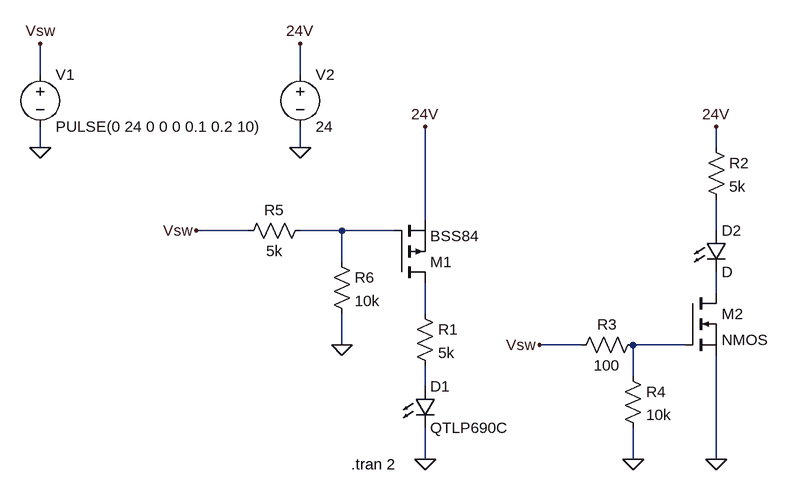
[diagram p0: schematic PMOS_OPEN_CKT_DETECT.asc]
PMOS_OPEN_CKT_DETECT.asc, the LTspice schematic file:
Version 4
SHEET 1 924 680
WIRE -592 -448 -592 -496
WIRE -192 -448 -192 -496
WIRE -592 -336 -592 -368
WIRE -192 -336 -192 -368
WIRE 448 -336 448 -368
WIRE 0 -224 0 -368
WIRE -272 -208 -352 -208
WIRE -128 -208 -192 -208
WIRE -48 -208 -128 -208
WIRE 448 -208 448 -256
WIRE -128 -160 -128 -208
WIRE 448 -112 448 -144
WIRE 0 -80 0 -128
WIRE -128 -32 -128 -80
WIRE 240 -32 176 -32
WIRE 400 -32 320 -32
WIRE 320 16 320 -32
WIRE 0 32 0 0
WIRE 0 144 0 96
WIRE 320 144 320 96
WIRE 448 144 448 -16
FLAG 0 144 0
FLAG 448 144 0
FLAG 448 -368 24V
FLAG 320 144 0
FLAG -128 -32 0
FLAG 176 -32 Vsw
FLAG -592 -336 0
FLAG -192 -336 0
FLAG -192 -496 24V
FLAG -592 -496 Vsw
FLAG -352 -208 Vsw
FLAG 0 -368 24V
SYMBOL pmos -48 -128 M180
SYMATTR InstName M1
SYMATTR Value BSS84
SYMBOL nmos 400 -112 R0
SYMATTR InstName M2
SYMBOL res -16 -96 R0
SYMATTR InstName R1
SYMATTR Value 5k
SYMBOL LED -16 32 R0
SYMATTR InstName D1
SYMATTR Value QTLP690C
SYMBOL res 432 -352 R0
SYMATTR InstName R2
SYMATTR Value 5k
SYMBOL LED 432 -208 R0
SYMATTR InstName D2
SYMBOL res 224 -16 R270
WINDOW 0 32 56 VTop 2
WINDOW 3 0 56 VBottom 2
SYMATTR InstName R3
SYMATTR Value 100
SYMBOL res 304 0 R0
SYMATTR InstName R4
SYMATTR Value 10k
SYMBOL res -288 -192 R270
WINDOW 0 32 56 VTop 2
WINDOW 3 0 56 VBottom 2
SYMATTR InstName R5
SYMATTR Value 5k
SYMBOL res -144 -176 R0
SYMATTR InstName R6
SYMATTR Value 10k
SYMBOL voltage -592 -464 R0
WINDOW 123 0 0 Left 0
WINDOW 39 0 0 Left 0
SYMATTR InstName V1
SYMATTR Value PULSE(0 24 0 0 0 0.1 0.2 10)
SYMBOL voltage -192 -464 R0
WINDOW 123 0 0 Left 0
WINDOW 39 0 0 Left 0
SYMATTR InstName V2
SYMATTR Value 24
TEXT -114 152 Left 2 !.tran 2

The netlist it stands for:
* PMOS_OPEN_CKT_DETECT.asc
M1 N004 N001 24V 24V BSS84
M2 N003 N005 0 0 NMOS
R1 N004 N006 5k
D1 N006 0 QTLP690C
R2 24V N002 5k
D2 N002 N003 D
R3 Vsw N005 100
R4 N005 0 10k
R5 Vsw N001 5k
R6 N001 0 10k
V1 Vsw 0 PULSE(0 24 0 0 0 0.1 0.2 10)
V2 24V 0 24
.model D D
.lib standard.dio
.model NMOS NMOS
.model PMOS PMOS
.lib standard.mos
.tran 2
.backanno
.end